# Altium schematic sheet PPM.SchDoc
size A4
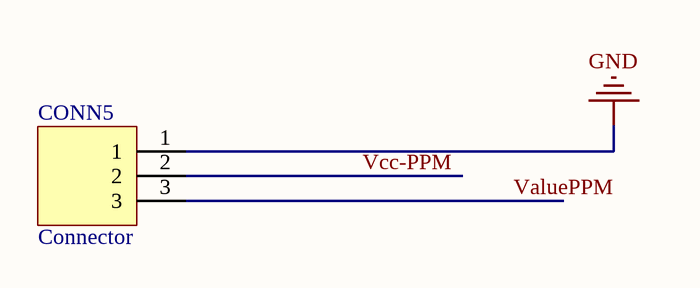
[diagram p0: PPM.SchDoc]

## Parts
CONN5  Connector  [SEN0203]

## Nets
GND: CONN5.1
ValuePPM: CONN5.3
Vcc-PPM: CONN5.2

## Library data of the parts
CONN5 = Header 1x3: Con PPM